# Altium schematic sheet 总图.SchDoc
size A3
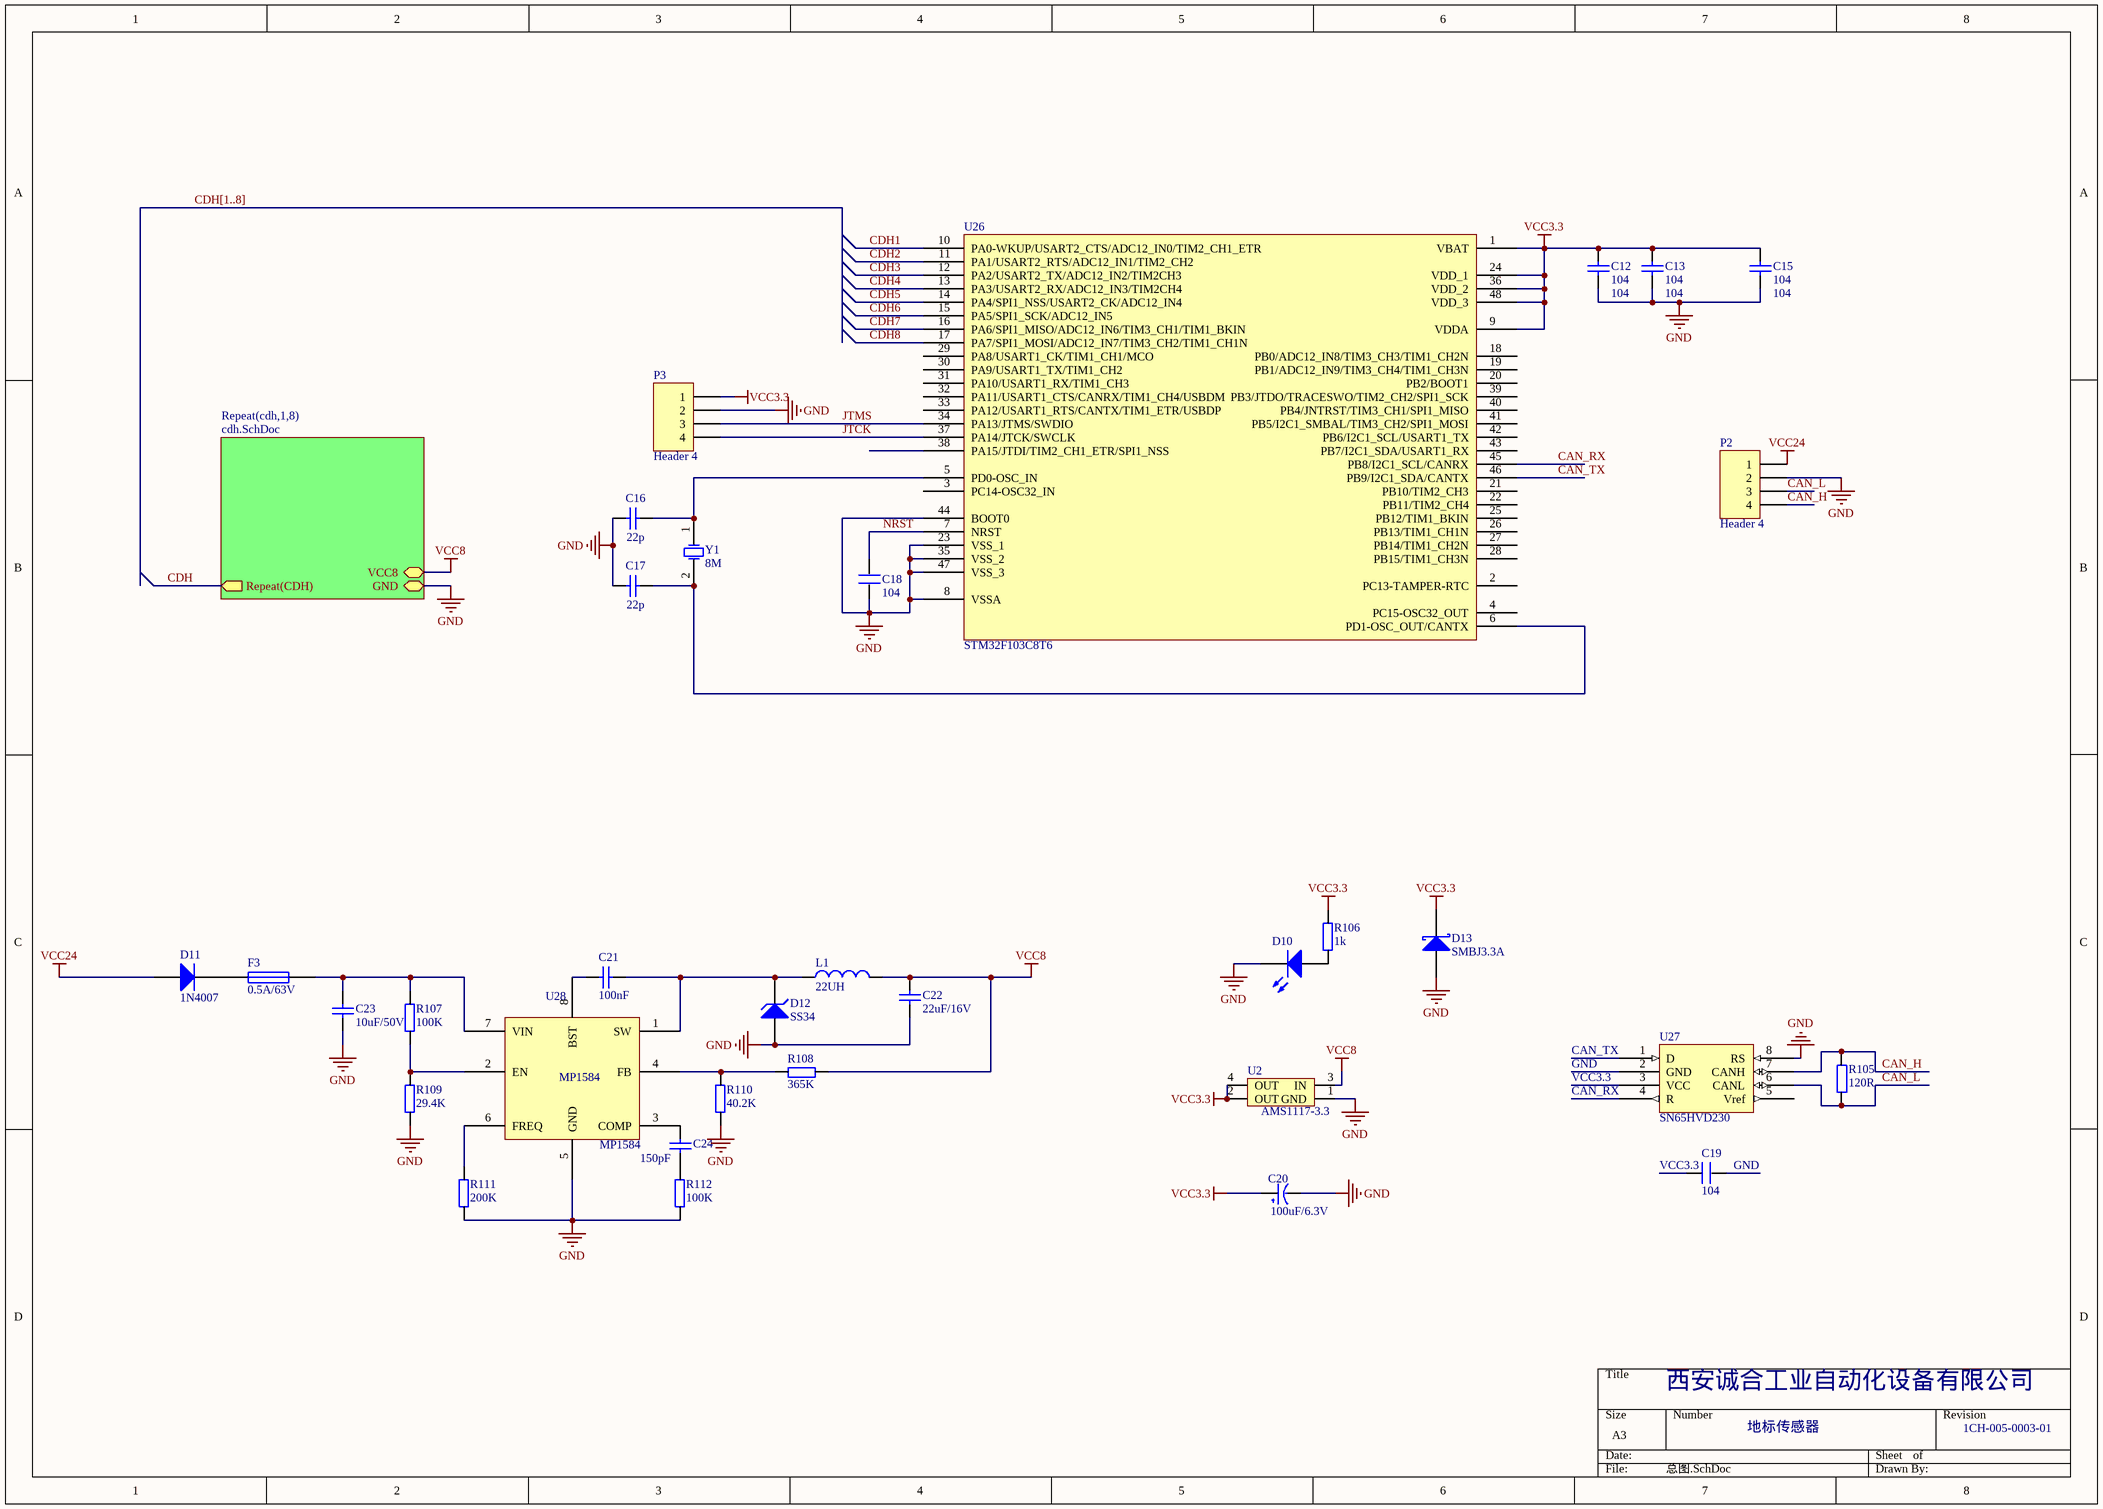
[diagram p0: 总图.SchDoc]

## Parts
C12  104  [0603-CAP]
C13  104  [0603-CAP]
C15  104  [0603-CAP]
C16  22p  [0603-CAP]
C17  22p  [0603-CAP]
C18  104  [0603-CAP]
C19  104  [0603-CAP]
C20  100uF/6.3V  [3216]
C21  value 100nF  [0603-CAP]  (hidden comment: 0.1uF)
C22  22uF/16V  [1206]
C23  10uF/50V  [1206]
C24  value 150pF  [0603-CAP]  (hidden comment: 0.1uF)
D10  LED0  [LC-0805_LED_S1]  (value not drawn)
D11  1N4007  [SMA(DO-214AC)_S1]
D12  SS34  [SMA(DO-214AC)_S1]
D13  SMBJ3.3A  [SMB(DO-214AA)_S1]
F3  0.5A/63V  [1206]
L1  22UH  [L-7*7*4mm-S]
P2  Header 4  [DZ-4-3.5]
P3  Header 4  [HDR1X4]
R105  120R  [0603]
R106  1k  [0603]
R107  100K  [0603]
R108  365K  [0603]
R109  29.4K  [0603]
R110  40.2K  [0603]
R111  200K  [0603]
R112  100K  [0603]
U2  AMS1117-3.3  [LC-SOT-223]
U26  STM32F103C8T6  [LC-LQFP-48]
U27  SN65HVD230  [SOP-8]
U28  MP1584  [SO-8]
Y1  8M  [XTAL_US1]

## Sub-sheets
Repeat(cdh,1,8) = cdh.SchDoc: GND (bidir), VCC8 (bidir), Repeat(CDH) (out)

## Nets
GND: C12.2 C13.2 C15.2 C16.2 C17.2 C18.1 C19.2 C20.2(GND) C22.1 C23.2 D10.K D12.1(A) D13.2(A) P2.2 P3.2 R109.2 R110.2 R111.2 R112.2 U2.1(GND) U26.8(VSSA) U26.23(VSS_1) U26.35(VSS_2) U26.44(BOOT0) U26.47(VSS_3) U27.2(GND) U27.8(RS) U28.5(GND) ; sheet Repeat(cdh,1,8)/GND
VCC3.3: C12.1 C13.1 C15.1 C19.1 C20.1(VCC) D13.1(K) P3.1 R106.1 U2.2(OUT) U2.4(OUT) U26.1(VBAT) U26.9(VDDA) U26.24(VDD_1) U26.36(VDD_2) U26.48(VDD_3) U27.3(VCC)
VCC8: C22.2 L1.2 R108.2 U2.3(IN) ; sheet Repeat(cdh,1,8)/VCC8
VCC24: D11.1(A) P2.1
CAN_H: P2.4 R105.2 U27.7(CANH)
CAN_L: P2.3 R105.1 U27.6(CANL)
CAN_RX: U26.45(PB8/I2C1_SCL/CANRX) U27.4(R)
CAN_TX: U26.46(PB9/I2C1_SDA/CANTX) U27.1(D)
CDH: sheet Repeat(cdh,1,8)/Repeat(CDH)
CDH1: U26.10(PA0-WKUP/USART2_CTS/ADC12_IN0/TIM2_CH1_ETR)
CDH2: U26.11(PA1/USART2_RTS/ADC12_IN1/TIM2_CH2)
CDH3: U26.12(PA2/USART2_TX/ADC12_IN2/TIM2CH3)
CDH4: U26.13(PA3/USART2_RX/ADC12_IN3/TIM2CH4)
CDH5: U26.14(PA4/SPI1_NSS/USART2_CK/ADC12_IN4)
CDH6: U26.15(PA5/SPI1_SCK/ADC12_IN5)
CDH7: U26.16(PA6/SPI1_MISO/ADC12_IN6/TIM3_CH1/TIM1_BKIN)
CDH8: U26.17(PA7/SPI1_MOSI/ADC12_IN7/TIM3_CH2/TIM1_CH1N)
JTCK: P3.4 U26.37(PA14/JTCK/SWCLK)
JTMS: P3.3 U26.34(PA13/JTMS/SWDIO)
NRST: C18.2 U26.7(NRST)
NetC16_1: C16.1 U26.5(PD0-OSC_IN) Y1.1(OSC1)
NetC17_1: C17.1 U26.6(PD1-OSC_OUT/CANTX) Y1.2(OSC2)
NetC21_1: C21.1 D12.2(K) L1.1 U28.1(SW)
NetC21_2: C21.2 U28.8(BST)
NetC23_1: C23.1 F3.2 R107.1 U28.7(VIN)
NetC24_1: C24.1 R112.1
NetC24_2: C24.2 U28.3(COMP)
NetD10_A: D10.A R106.2
NetD11_2: D11.2(K) F3.1
NetR107_2: R107.2 R109.1 U28.2(EN)
NetR108_1: R108.1 R110.1 U28.4(FB)
NetR111_1: R111.1 U28.6(FREQ)

Not connected (* = marked no-connect by the designer): U26 2(PC13-TAMPER-RTC) 3(PC14-OSC32_IN) 4(PC15-OSC32_OUT) 18(PB0/ADC12_IN8/TIM3_CH3/TIM1_CH2N) 19(PB1/ADC12_IN9/TIM3_CH4/TIM1_CH3N) 20(PB2/BOOT1) 21(PB10/TIM2_CH3) 22(PB11/TIM2_CH4) 25(PB12/TIM1_BKIN) 26(PB13/TIM1_CH1N) 27(PB14/TIM1_CH2N) 28(PB15/TIM1_CH3N) 29(PA8/USART1_CK/TIM1_CH1/MCO) 30(PA9/USART1_TX/TIM1_CH2) 31(PA10/USART1_RX/TIM1_CH3) 32(PA11/USART1_CTS/CANRX/TIM1_CH4/USBDM) 33(PA12/USART1_RTS/CANTX/TIM1_ETR/USBDP) 38(PA15/JTDI/TIM2_CH1_ETR/SPI1_NSS) 39(PB3/JTDO/TRACESWO/TIM2_CH2/SPI1_SCK) 40(PB4/JNTRST/TIM3_CH1/SPI1_MISO) 41(PB5/I2C1_SMBAL/TIM3_CH2/SPI1_MOSI) 42(PB6/I2C1_SCL/USART1_TX) 43(PB7/I2C1_SDA/USART1_RX); U27 5(Vref)

## Buses and harness runs
bus CDH[1..8]

## Notes on the sheet
- 西安诚合工业自动化设备有限公司
- 地标传感器
- 1CH-005-0003-01

## Library data of the parts
C12 C13 C15-C17 = Cap: Capacitor; Published: 8-Jun-2000; LatestRevisionDate: 17-Jul-2002; LatestRevisionNote: Re-released for DXP Platform.; PackageReference: RAD-0.3; Publisher: Altium Limited; PackageDescription: Radial Cap, Thru-Hole; 2 Leads; 0.3 in Pin Spacing
  C12 C13 C15: Value: 104
  C16 C17: Value: 22p
C18 = C
C19 = C_3
C20 = CAP
C21-C24 = Cap Semi: Capacitor (Semiconductor SIM Model); Published: 8-Jun-2000; LatestRevisionDate: 29-May-2009; LatestRevisionNote: IPC-7351 Footprint Added.; PackageReference: C1206; Publisher: Altium Limited; PackageDescription: Chip Capacitor
  C22: Value: 22uF/16V
  C23: Value: 10uF/50V
D10 = LED0: Typical INFRARED GaAs LED; Published: 8-Jun-2000; LatestRevisionDate: 08-Jul-2005; LatestRevisionNote: Mech Layer 1 removed.; PackageReference: LED-0; Publisher: Altium Limited; PackageDescription: LED; 2 Leads
D11 = Diode: Default Diode; Published: 8-Jun-2000; LatestRevisionDate: 17-Jul-2002; LatestRevisionNote: Re-released for DXP Platform.; PackageVersion: Sep-1996; PackageReference: SMC; Publisher: Altium Limited; PackageDescription: DO-214-AB/SMC; 2 C-Bend Leads; Body 7.9 x 5.9 mm, inc. leads (LxW); Code_JEDEC: DO-214-AB
D12 = D Zener: Zener Diode; Published: 8-Jun-2000; LatestRevisionDate: 17-Jul-2002; LatestRevisionNote: Re-released for DXP Platform.; PackageReference: DIODE-0.7; Publisher: Altium Limited; PackageDescription: Diode, Thru-Hole; 2 Leads; 0.7 in Pin Spacing
D13 = Diode 18TQ045: Schottky Rectifier; Note: Terminal 2 is the TAB and is electrically connected to the cathode; Published: 8-Jun-2000; LatestRevisionDate: 17-Jul-2002; LatestRevisionNote: Re-released for DXP Platform.; DatasheetVersion: Dec-1997; PackageVersion: Feb-1998; PackageReference: TO-220AC; Publisher: Altium Limited; PackageDescription: TO, Thru-Hole, Vertical, Heatsink Mounted; 3 In-Line Leads (1 Absent); Pitch 2.54 mm; ComponentLink1Description: Manufacturer Link; ComponentLink1URL: http://www.irf.com/; ComponentLink2Description: Datasheet; ComponentLink2URL: http://www.irf.com/product-info/datasheets/data/18tq.pdf
F3 = Fuse 1: Fuse; Published: 8-Jun-2000; LatestRevisionDate: 17-Jul-2002; LatestRevisionNote: Re-released for DXP Platform.; PackageReference: PIN-W2/E2.8; Publisher: Altium Limited; PackageDescription: Thru-Hole; 2 Leads
L1 = Inductor: Code_IEC: 1005; Published: 8-Jun-2000; LatestRevisionDate: 29-May-2009; LatestRevisionNote: IPC-7351 Footprint Added.; PackageReference: 0402-A; Publisher: Altium Limited; PackageDescription: Chip Inductor; Code_JEITA: 0402; Value: 22uH
P2 P3 = Header 4: Header, 4-Pin; LatestRevisionDate: 17-Jul-2002; LatestRevisionNote: Re-released for DXP Platform.; Publisher: Altium Limited
R105-R112 = R_2
U2 = AMS1117
U26 = stm32f103v8t6
U27 = SN65HVD230D
U28 = MP1584EN
Y1 = XTAL: Crystal Oscillator; Published: 8-Jun-2000; LatestRevisionDate: 17-Jul-2002; LatestRevisionNote: Re-released for DXP Platform.; PackageReference: R38; Publisher: Altium Limited; PackageDescription: Crystal, Thru-Hole; 2 Leads; Body 3.1 x 8.2 mm (Dia.xH)